# EAGLE schematic ReflexHammerSchematic (EAGLE 9.6.0)
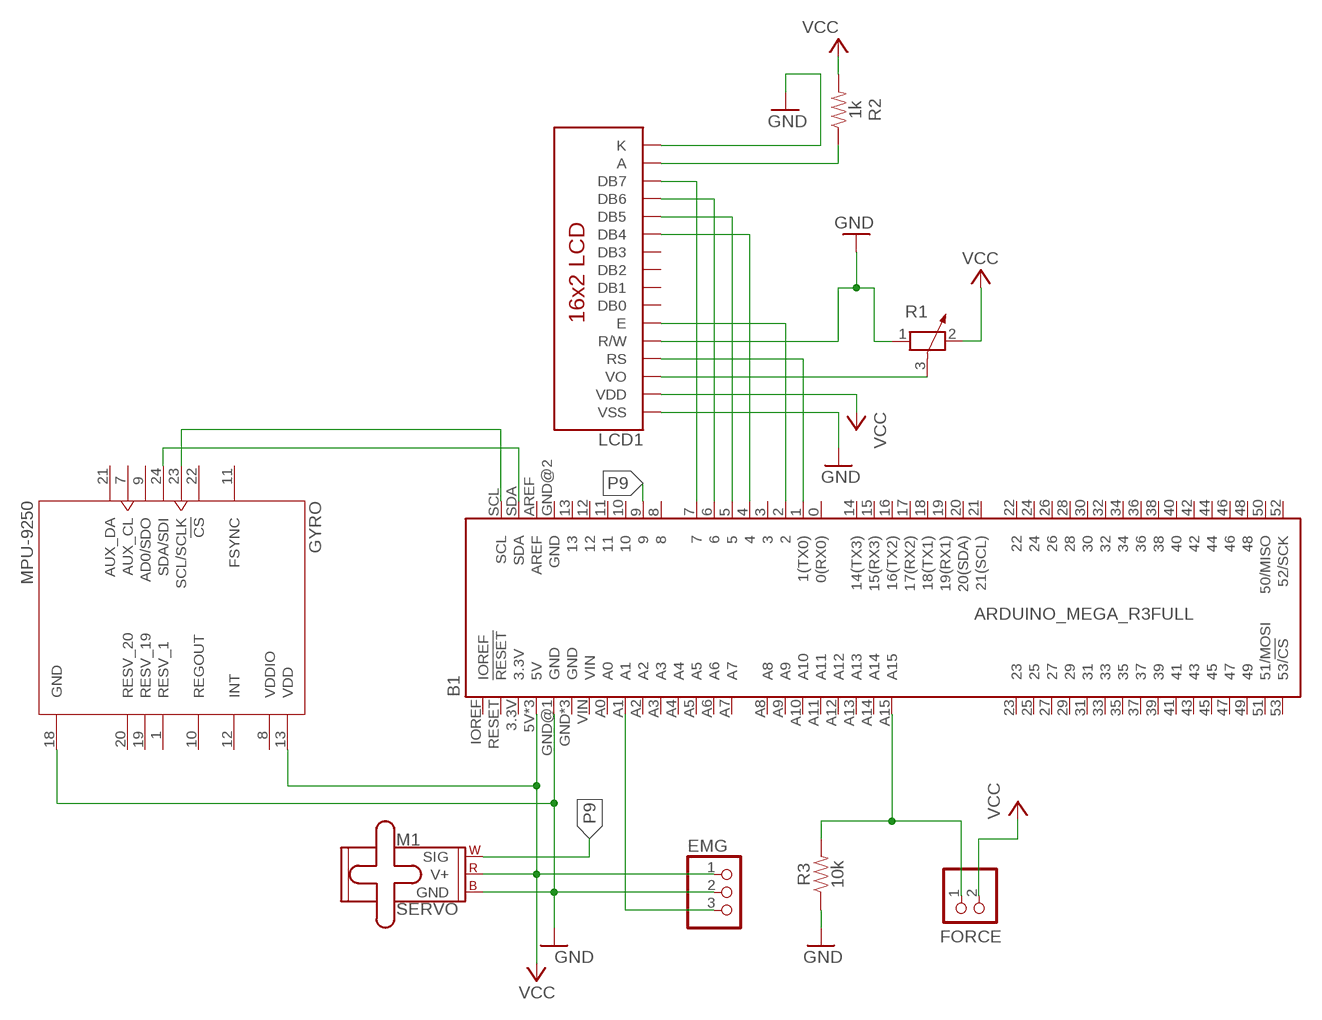
[diagram p0: schematic, sheet 1]

## Parts
B1  ARDUINO_MEGA_R3FULL  [ARDUINO_MEGA_NO_SILK]
EMG  PINHD-1X3  [1X03]
FORCE  JST_2PIN-SMT  [JST-PH-2-SMT]
GYRO  MPU-9250  [QFN40P300X300X105-24N]
LCD1  LCD-16X2NOHOLES  [LCD-16X2_NOHOLESNOSILK]
M1  SERVO  [1X03]
R1  POTENTIOMETER_PT-10  [PT-10]
R2  1k  1KOHM-HORIZ-1/4W-1%  [AXIAL-0.3]
R3  10k  10KOHM-0402-1/16W-1%  [0402]

## Nets
GND: B1.GND@1(GND) EMG.2 GYRO.18(GND) LCD1.1(VSS) LCD1.5(R/W) LCD1.16(K) M1.3(GND) R1.1 R3.1
N$2: B1.A1 EMG.3
N$4: B1.7 LCD1.14(DB7)
N$5: LCD1.15(A) R2.P$1
N$6: B1.6 LCD1.13(DB6)
N$7: B1.5 LCD1.12(DB5)
N$8: B1.4 LCD1.11(DB4)
N$9: B1.A15 FORCE.1 R3.2
N$10: B1.2 LCD1.6(E)
N$11: B1.1(1(TX0)) LCD1.4(RS)
N$13: LCD1.3(VO) R1.3
N$14: B1.SDA GYRO.24(SDA/SDI)
N$15: B1.SCL GYRO.23(SCL/SCLK)
P9: B1.9 M1.1(SIG)
VCC: B1.5V B1.5V@1(5V) B1.5V@2(5V) EMG.1 FORCE.2 GYRO.13(VDD) LCD1.2(VDD) M1.2(V+) R1.2 R2.P$2
Unconnected: B1.0(0(RX0)) B1.3 B1.3.3V B1.8 B1.10 B1.11 B1.12 B1.13 B1.14(14(TX3)) B1.15(15(RX3)) B1.16(16(TX2)) B1.17(17(RX2)) B1.18(18(TX1)) B1.19(19(RX1)) B1.20(20(SDA)) B1.21(21(SCL)) B1.22 B1.23 B1.24 B1.25 B1.26 B1.27 B1.28 B1.29 B1.30 B1.31 B1.32 B1.33 B1.34 B1.35 B1.36 B1.37 B1.38 B1.39 B1.40 B1.41 B1.42 B1.43 B1.44 B1.45 B1.46 B1.47 B1.48 B1.49 B1.50(50/MISO) B1.51(51/MOSI) B1.52(52/SCK) B1.53(53/!CS) B1.A0 B1.A2 B1.A3 B1.A4 B1.A5 B1.A6 B1.A7 B1.A8 B1.A9 B1.A10 B1.A11 B1.A12 B1.A13 B1.A14 B1.AREF B1.GND B1.GND@2(GND) B1.GND@3(GND) B1.GND@4(GND) B1.IOREF B1.RESET(!RESET) B1.VIN GYRO.1(RESV_1) GYRO.7(AUX_CL) GYRO.9(AD0/SDO) GYRO.10(REGOUT) GYRO.11(FSYNC) GYRO.12(INT) GYRO.19(RESV_19) GYRO.20(RESV_20) GYRO.21(AUX_DA) GYRO.22(!CS) LCD1.7(DB0) LCD1.8(DB1) LCD1.9(DB2) LCD1.10(DB3)

## Power pins joined to a net without a drawn wire
VDDIO: GYRO.8(VDDIO)

## Library data of the parts
B1 = SparkFun-Boards:ARDUINO_MEGA_R3: Arduino Mega R3 ATmega2560 R3 compatible footprint. SparkFun Products: Arduino Mega 2560 R3 <https://www.sparkfun.com/products/11061>
EMG = adafruit:PINHD-1X3: PIN HEADER
FORCE = adafruit:JST_2PIN: JST 2-Pin Connectors of various flavors SMT-RA (S2B-PH-SM4) 4UConnector #17311 SMT (B2B-PH-SM4) THM-RA (S2B-PH) THM (B2B-PH)
GYRO = MPU-9250:MPU-9250: Axis=3 Axis Gyro+3 Axis Accel+Compass. Pin For Pin With m; AVAILABILITY: Unavailable; DESCRIPTION: Accelerometer, Gyroscope, Magnetometer, 9 Axis Sensor I²C, SPI Output; MF: TDK InvenSense; MP: MPU-9250; PACKAGE: TFQFN-24 TDK InvenSense; PRICE: None
LCD1 = SparkFun-Displays:LCD-16X2: Standard text-only 16x2 parallel input LCD Basic 16 character by 2 line display. Typically utilizes the extremely common HD44780 parallel interface chipset SparkFun Products: Basic 16x2 Green <https://www.sparkfun.com/products/255> Basic 8x2 Green <https://www.sparkfun.com/products/11122>; SF_ID: LCD-00255
M1 = SparkFun-Electromechanical:SERVO: Servo Motor 3-pin connector for a standard servo motor (voltage supply, ground, and control signal.) SparkFun Products Servo - Generic (Sub-Micro Size) <https://www.sparkfun.com/products/9065> (ROB-09065) Servo - Generic High Torque Continuous Rotation (Standard Size) <https://www.sparkfun.com/products/9347> (ROB-09347) Servo - Generic High Torque (Standard Size) <https://www.sparkfun.com/products/11965> (ROB-11965)
R1 = rcl:POTENTIOMETER_: Potentiometer; SPICEMODEL: POT; SPICEPREFIX: X
R2 = SparkFun-Resistors:1KOHM: 1kΩ resistor A resistor is a passive two-terminal electrical component that implements electrical resistance as a circuit element. Resistors act to reduce current flow, and, at the same time, act to lower voltage levels within circuits. - Wikipedia; PROD_ID: RES-12182
R3 = SparkFun-Resistors:10KOHM: 10kΩ resistor A resistor is a passive two-terminal electrical component that implements electrical resistance as a circuit element. Resistors act to reduce current flow, and, at the same time, act to lower voltage levels within circuits. - Wikipedia; PROD_ID: RES-14241